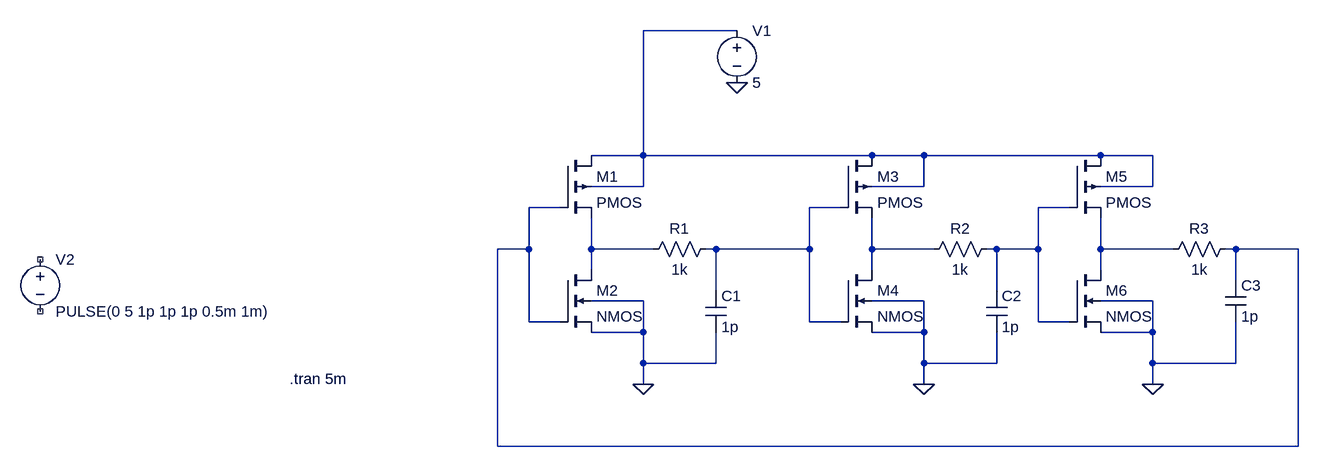
[diagram p0: schematic fet nots.asc]
fet nots.asc, the LTspice schematic file:
Version 4
SHEET 1 1332 680
WIRE 464 -32 320 -32
WIRE 320 160 320 -32
WIRE 320 160 240 160
WIRE 672 160 320 160
WIRE 752 160 672 160
WIRE 1024 160 752 160
WIRE 1104 160 1024 160
WIRE 320 208 320 160
WIRE 320 208 240 208
WIRE 752 208 752 160
WIRE 752 208 672 208
WIRE 1104 208 1104 160
WIRE 1104 208 1024 208
WIRE 192 240 144 240
WIRE 624 240 576 240
WIRE 976 240 928 240
WIRE 144 304 144 240
WIRE 144 304 96 304
WIRE 240 304 240 256
WIRE 336 304 240 304
WIRE 432 304 416 304
WIRE 576 304 576 240
WIRE 576 304 432 304
WIRE 672 304 672 256
WIRE 768 304 672 304
WIRE 864 304 848 304
WIRE 928 304 928 240
WIRE 928 304 864 304
WIRE 1024 304 1024 256
WIRE 1136 304 1024 304
WIRE 1232 304 1216 304
WIRE 1328 304 1232 304
WIRE 240 336 240 304
WIRE 672 336 672 304
WIRE 1024 336 1024 304
WIRE 1232 352 1232 304
WIRE 432 368 432 304
WIRE 864 368 864 304
WIRE 320 384 240 384
WIRE 752 384 672 384
WIRE 1104 384 1024 384
WIRE 144 416 144 304
WIRE 192 416 144 416
WIRE 576 416 576 304
WIRE 624 416 576 416
WIRE 928 416 928 304
WIRE 976 416 928 416
WIRE 320 432 320 384
WIRE 320 432 240 432
WIRE 752 432 752 384
WIRE 752 432 672 432
WIRE 1104 432 1104 384
WIRE 1104 432 1024 432
WIRE 320 480 320 432
WIRE 432 480 432 432
WIRE 432 480 320 480
WIRE 752 480 752 432
WIRE 864 480 864 432
WIRE 864 480 752 480
WIRE 1104 480 1104 432
WIRE 1232 480 1232 416
WIRE 1232 480 1104 480
WIRE 320 512 320 480
WIRE 752 512 752 480
WIRE 1104 512 1104 480
WIRE 96 608 96 304
WIRE 1328 608 1328 304
WIRE 1328 608 96 608
FLAG 464 48 0
FLAG 320 512 0
FLAG 752 512 0
FLAG 1104 512 0
SYMBOL pmos4 192 160 R0
SYMATTR InstName M1
SYMBOL nmos4 192 336 R0
SYMATTR InstName M2
SYMBOL voltage 464 -48 R0
SYMATTR InstName V1
SYMATTR Value 5
SYMBOL pmos4 624 160 R0
SYMATTR InstName M3
SYMBOL nmos4 624 336 R0
SYMATTR InstName M4
SYMBOL pmos4 976 160 R0
SYMATTR InstName M5
SYMBOL nmos4 976 336 R0
SYMATTR InstName M6
SYMBOL res 432 288 R90
WINDOW 0 0 56 VBottom 2
WINDOW 3 32 56 VTop 2
SYMATTR InstName R1
SYMATTR Value 1k
SYMBOL res 864 288 R90
WINDOW 0 0 56 VBottom 2
WINDOW 3 32 56 VTop 2
SYMATTR InstName R2
SYMATTR Value 1k
SYMBOL res 1232 288 R90
WINDOW 0 0 56 VBottom 2
WINDOW 3 32 56 VTop 2
SYMATTR InstName R3
SYMATTR Value 1k
SYMBOL cap 416 368 R0
SYMATTR InstName C1
SYMATTR Value 1p
SYMBOL cap 848 368 R0
SYMATTR InstName C2
SYMATTR Value 1p
SYMBOL cap 1216 352 R0
SYMATTR InstName C3
SYMATTR Value 1p
SYMBOL voltage -608 304 R0
WINDOW 123 0 0 Left 0
WINDOW 39 0 0 Left 0
SYMATTR InstName V2
SYMATTR Value PULSE(0 5 1p 1p 1p 0.5m 1m)
TEXT -224 504 Left 2 !.tran 5m

The netlist it stands for:
* fet nots.asc
M1 N001 N002 N005 N001 PMOS
M2 N005 N002 0 0 NMOS
V1 N001 0 5
M3 N001 N003 N006 N001 PMOS
M4 N006 N003 0 0 NMOS
M5 N001 N004 N007 N001 PMOS
M6 N007 N004 0 0 NMOS
R1 N003 N005 1k
R2 N004 N006 1k
R3 N002 N007 1k
C1 N003 0 1p
C2 N004 0 1p
C3 N002 0 1p
V2 NC_01 NC_02 PULSE(0 5 1p 1p 1p 0.5m 1m)
.model NMOS NMOS
.model PMOS PMOS
.lib standard.mos
.tran 5m
.backanno
.end